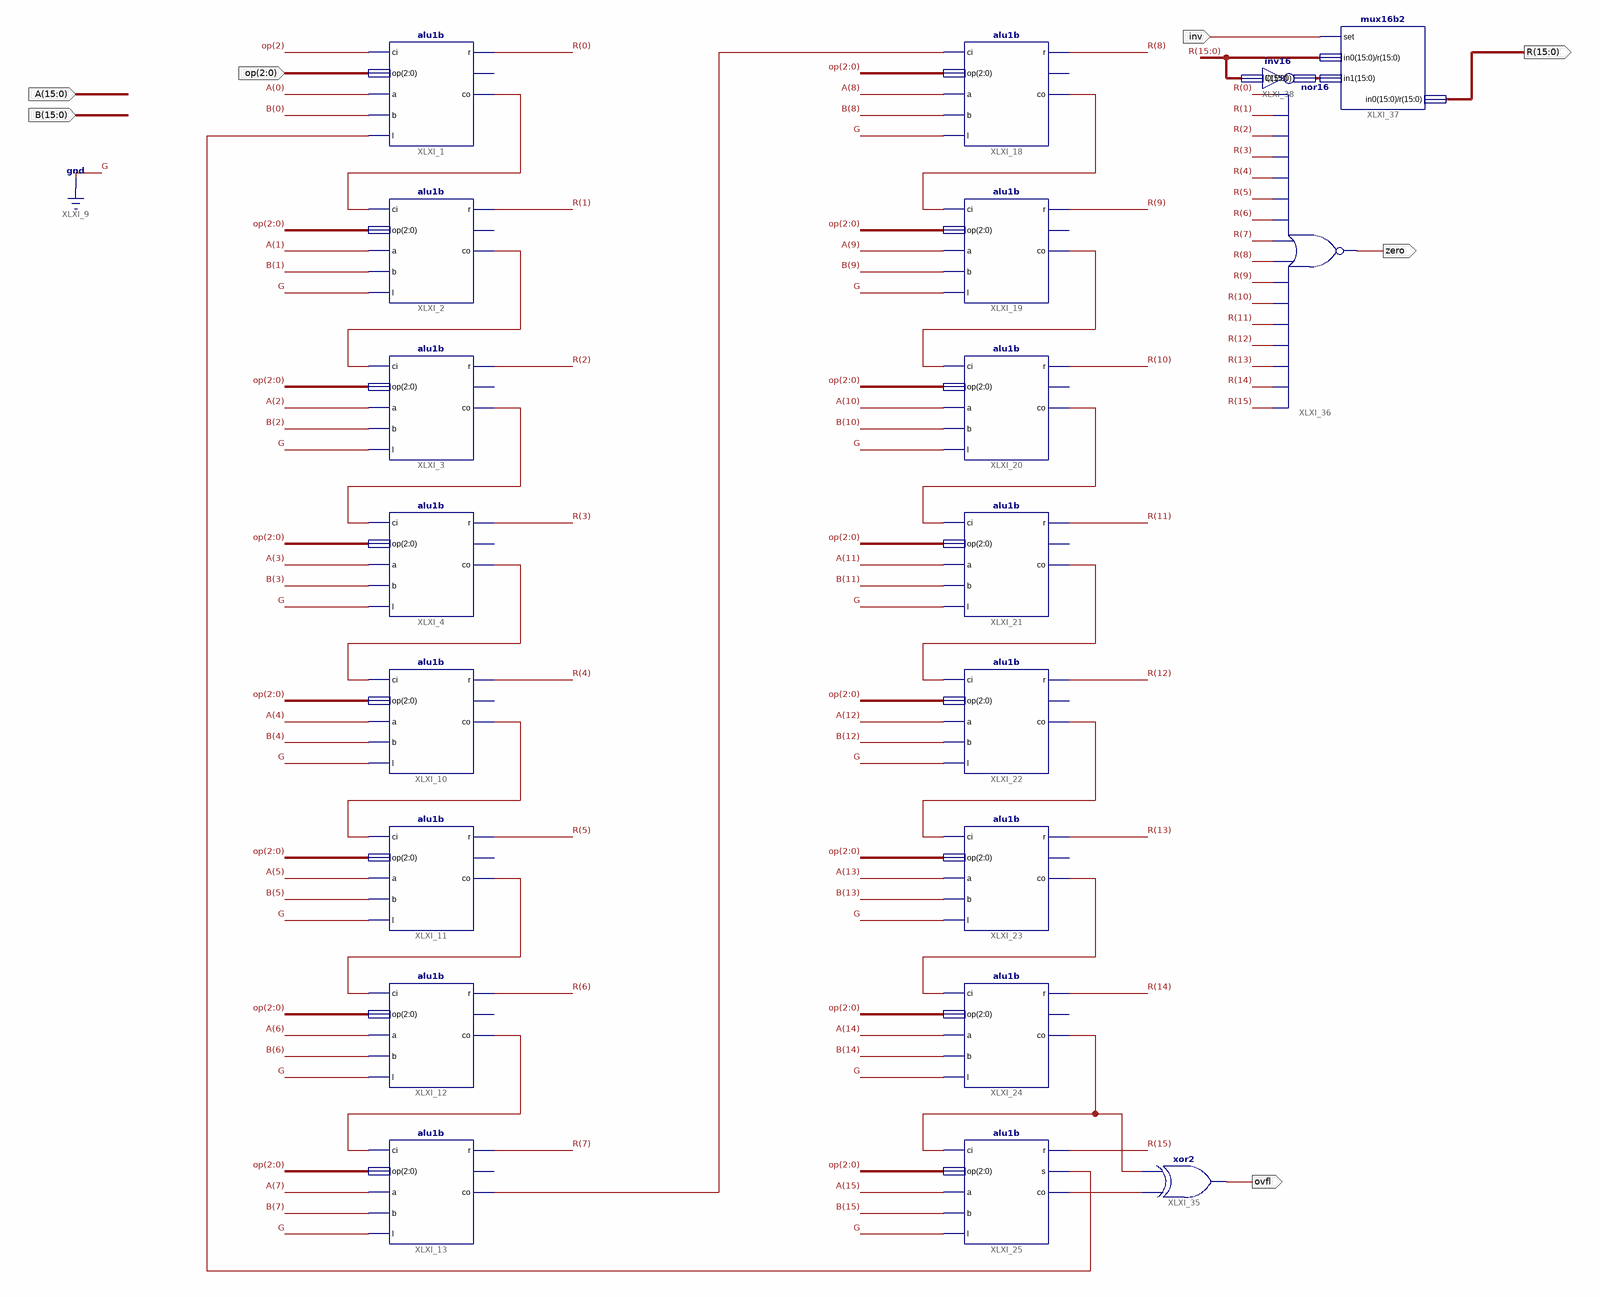
[diagram p0: schematic sheet 1]
// Xilinx ISE schematic alu16b.sch (spartan3e) as structural Verilog: 20 symbols, 8 ports
module alu16b (
  input  [2:0] op,
  input  [15:0] B,
  input  [15:0] A,
  input  inv,
  output ovfl,
  output zero,
  output [15:0] R
);

  wire XLXN_1, XLXN_2, XLXN_3, XLXN_6, XLXN_8, XLXN_10, XLXN_63, XLXN_65, XLXN_67, XLXN_89, XLXN_91, XLXN_93,
       XLXN_174, XLXN_175, XLXN_176, XLXN_177, XLXN_181;
  wire [15:0] XLXN_187;

  alu1b XLXI_1 (.a(A[0]), .b(B[0]), .ci(op[2]), .co(XLXN_1), .l(XLXN_177), .op(op), .r(R[0]));  // open: s
  alu1b XLXI_2 (.a(A[1]), .b(B[1]), .ci(XLXN_1), .co(XLXN_2), .l(1'b0), .op(op), .r(R[1]));  // open: s
  alu1b XLXI_3 (.a(A[2]), .b(B[2]), .ci(XLXN_2), .co(XLXN_3), .l(1'b0), .op(op), .r(R[2]));  // open: s
  alu1b XLXI_4 (.a(A[3]), .b(B[3]), .ci(XLXN_3), .co(XLXN_175), .l(1'b0), .op(op), .r(R[3]));  // open: s
  alu1b XLXI_10 (.a(A[4]), .b(B[4]), .ci(XLXN_175), .co(XLXN_6), .l(1'b0), .op(op), .r(R[4]));  // open: s
  alu1b XLXI_11 (.a(A[5]), .b(B[5]), .ci(XLXN_6), .co(XLXN_8), .l(1'b0), .op(op), .r(R[5]));  // open: s
  alu1b XLXI_12 (.a(A[6]), .b(B[6]), .ci(XLXN_8), .co(XLXN_10), .l(1'b0), .op(op), .r(R[6]));  // open: s
  alu1b XLXI_13 (.a(A[7]), .b(B[7]), .ci(XLXN_10), .co(XLXN_176), .l(1'b0), .op(op), .r(R[7]));  // open: s
  alu1b XLXI_18 (.a(A[8]), .b(B[8]), .ci(XLXN_176), .co(XLXN_63), .l(1'b0), .op(op), .r(R[8]));  // open: s
  alu1b XLXI_19 (.a(A[9]), .b(B[9]), .ci(XLXN_63), .co(XLXN_65), .l(1'b0), .op(op), .r(R[9]));  // open: s
  alu1b XLXI_20 (.a(A[10]), .b(B[10]), .ci(XLXN_65), .co(XLXN_67), .l(1'b0), .op(op), .r(R[10]));  // open: s
  alu1b XLXI_21 (.a(A[11]), .b(B[11]), .ci(XLXN_67), .co(XLXN_174), .l(1'b0), .op(op), .r(R[11]));  // open: s
  alu1b XLXI_22 (.a(A[12]), .b(B[12]), .ci(XLXN_174), .co(XLXN_89), .l(1'b0), .op(op), .r(R[12]));  // open: s
  alu1b XLXI_23 (.a(A[13]), .b(B[13]), .ci(XLXN_89), .co(XLXN_91), .l(1'b0), .op(op), .r(R[13]));  // open: s
  alu1b XLXI_24 (.a(A[14]), .b(B[14]), .ci(XLXN_91), .co(XLXN_93), .l(1'b0), .op(op), .r(R[14]));  // open: s
  alu1b XLXI_25 (.a(A[15]), .b(B[15]), .ci(XLXN_93), .co(XLXN_181), .l(1'b0), .op(op), .r(R[15]), .s(XLXN_177));
  xor XLXI_35 (ovfl, XLXN_181, XLXN_93);
  nor XLXI_36 (zero, R[15], R[14], R[13], R[12], R[11], R[10], R[9], R[8], R[7], R[6], R[5], R[4], R[3], R[2], R[1], R[0]);
  mux16b2 XLXI_37 (.set(inv), .in0(R), .in1(XLXN_187), .r(R));
  inv16 XLXI_38 (.I(R), .O(XLXN_187));
endmodule
